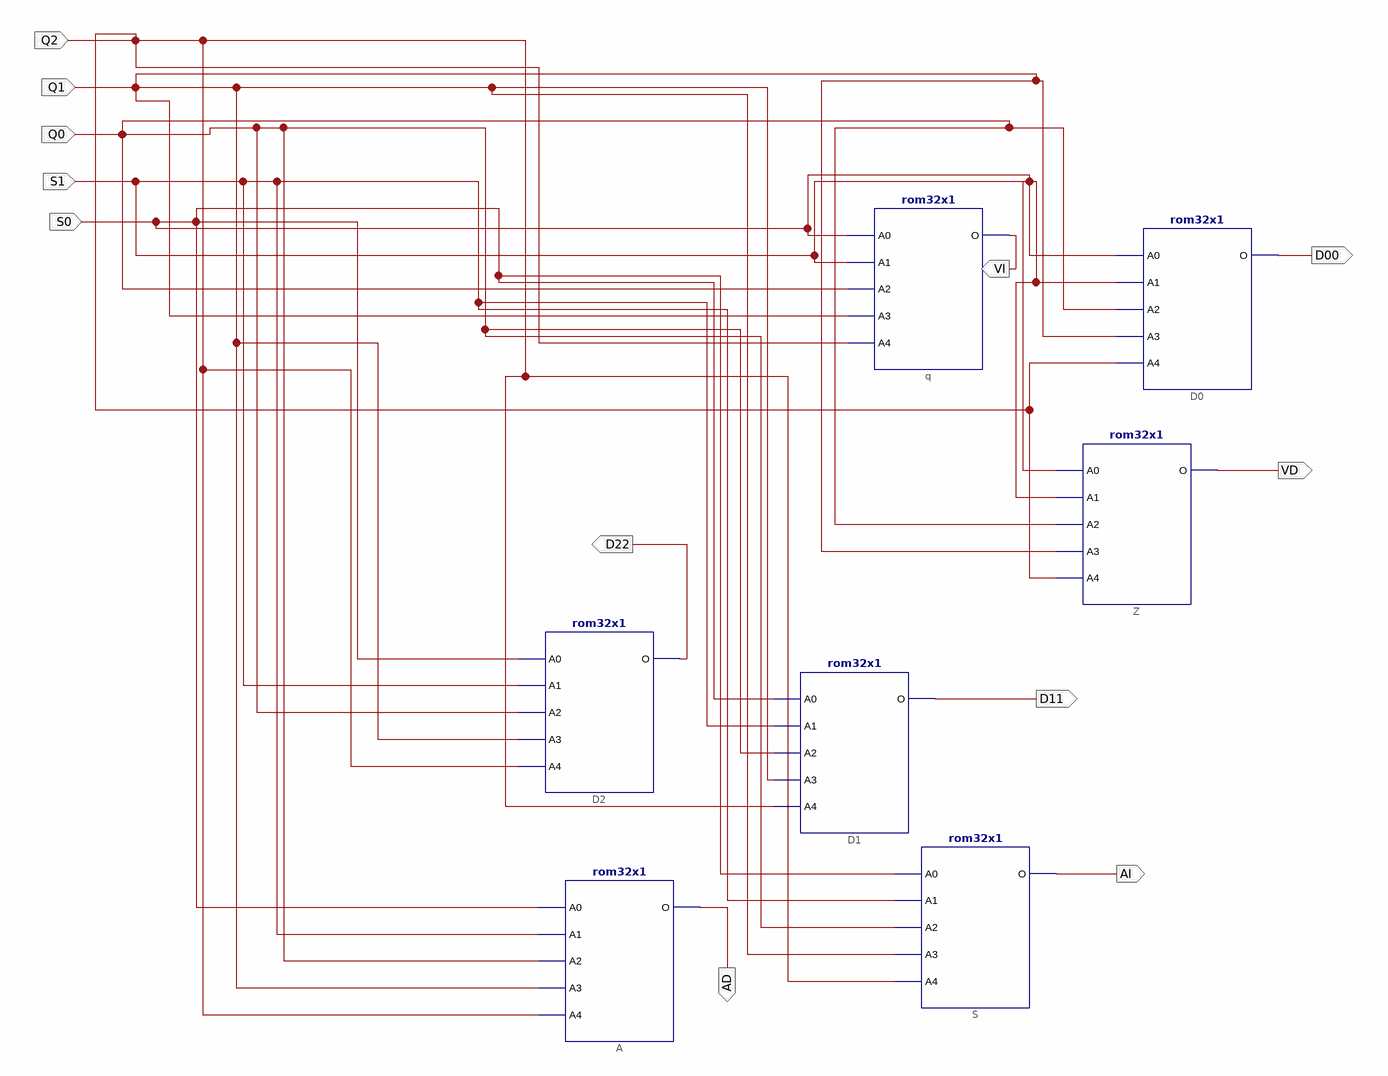
[diagram p0: schematic sheet 1]
// Xilinx ISE schematic memoria.sch (spartan3) as structural Verilog: 7 symbols, 12 ports
module memoria (
  input  Q2,
  input  Q1,
  input  Q0,
  input  S0,
  input  S1,
  output AD,
  output D11,
  output AI,
  output VD,
  output D00,
  output VI,
  output D22
);

  rom32x1 #(.INIT("0FF00FF0")) D1 (.A0(S0), .A1(S1), .A2(Q0), .A3(Q1), .A4(Q2), .O(D11));
  rom32x1 #(.INIT("F0000000")) S (.A0(S0), .A1(S1), .A2(Q0), .A3(Q1), .A4(Q2), .O(AI));
  rom32x1 #(.INIT("0000F000")) A (.A0(S0), .A1(S1), .A2(Q0), .A3(Q1), .A4(Q2), .O(AD));
  rom32x1 #(.INIT("0FFFF000")) D2 (.A0(S0), .A1(S1), .A2(Q0), .A3(Q1), .A4(Q2), .O(D22));
  rom32x1 #(.INIT("0FFF0000")) q (.A0(S0), .A1(S1), .A2(Q0), .A3(Q1), .A4(Q2), .O(VI));
  rom32x1 #(.INIT("0F0C0F0A")) D0 (.A0(S0), .A1(S1), .A2(Q0), .A3(Q1), .A4(Q2), .O(D00));
  rom32x1 #(.INIT("00000FFF")) Z (.A0(S0), .A1(S1), .A2(Q0), .A3(Q1), .A4(Q2), .O(VD));
endmodule
